# Altium schematic sheet [01] Main.SchDoc: Design 1
size Tabloid; Engineer: The ASID Designer; Organization: ASID Designer; Address1: Iran; Address2: Shiraz; Address3: P.O.Box 71765-385; DocumentNumber: 1; Revision: 1.0; SheetNumber: 1; SheetTotal: 1
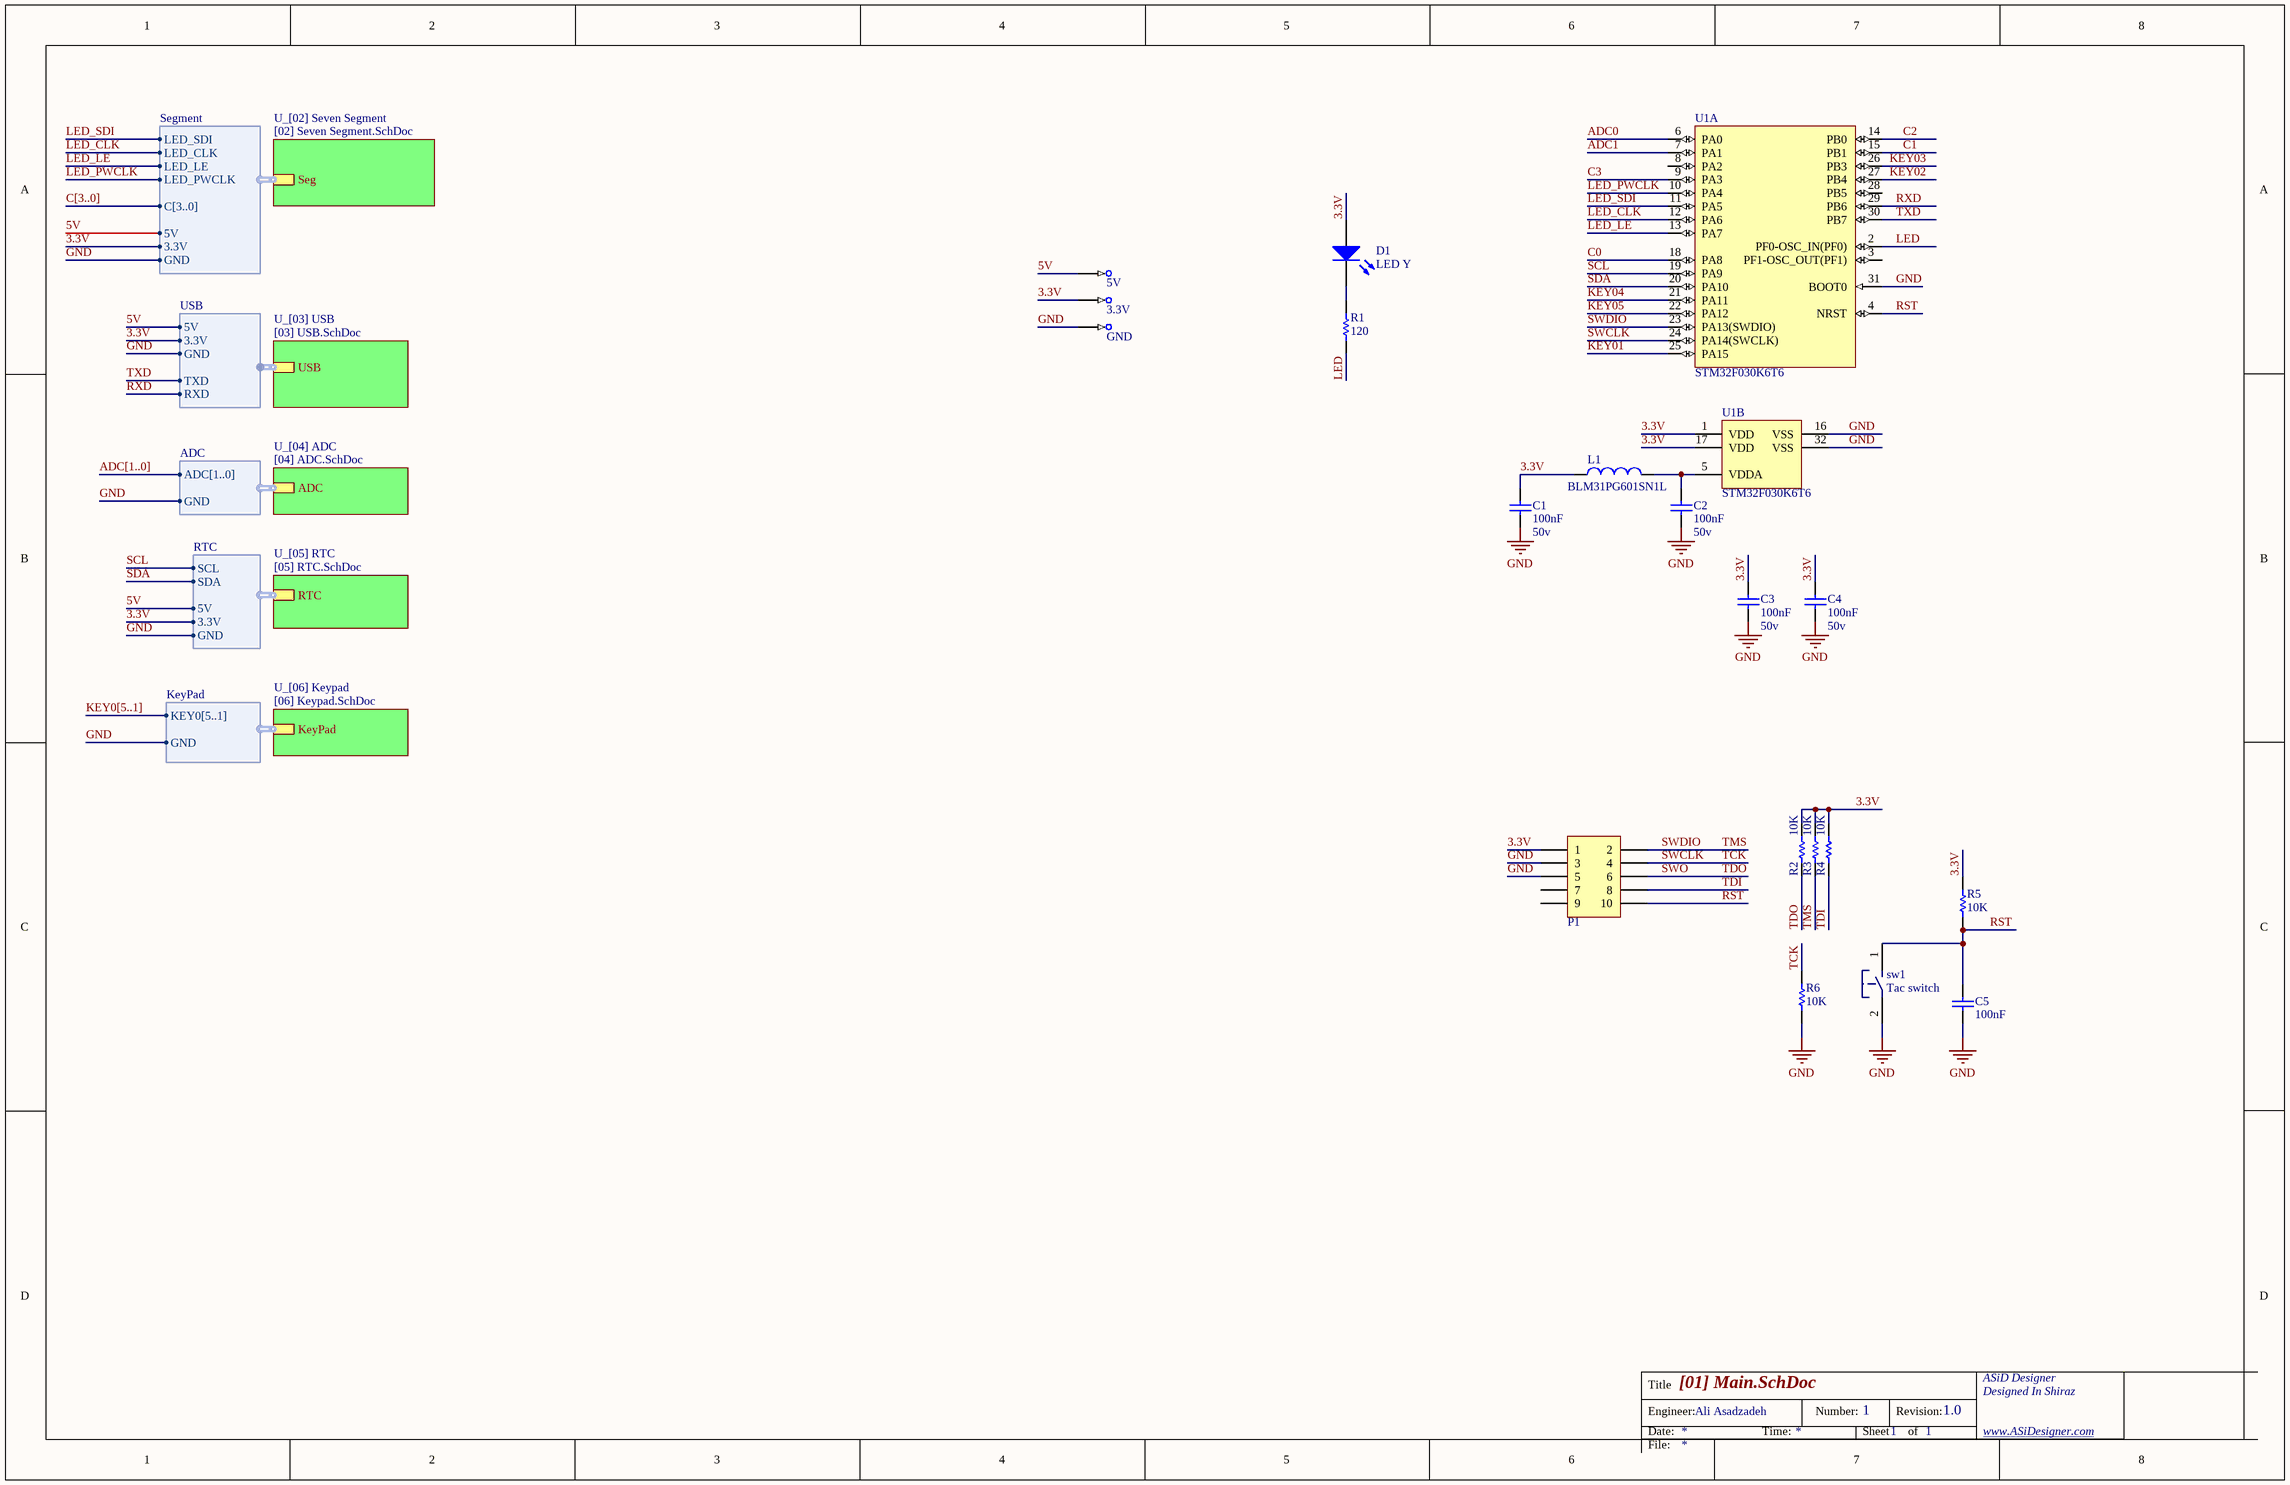
[diagram p0: [01] Main.SchDoc]

## Parts
C1  Volte: 50v  [MY_0603]  (hidden comment: 100nF)
C2  Volte: 50v  [MY_0603]  (hidden comment: 100nF)
C3  Volte: 50v  [MY_0603]  (hidden comment: 100nF)
C4  Volte: 50v  [MY_0603]  (hidden comment: 100nF)
C5  100nF  [MY_0805]
D1  LED Y  [MY_LED_0805]
L1  BLM31PG601SN1L  [MY_1206]
P1  Header 5X2  [MY_2X05_BOX]  (value not drawn)
R1  120  [MY_0805]
R2  10K  [MY_0805]
R3  10K  [MY_0805]
R4  10K  [MY_0805]
R5  10K  [MY_0805]
R6  10K  [MY_0805]
sw1  Tac switch  [MY_PB-SMD]
TP1  5V  [MY_TestPin]  (no BOM)
TP2  3.3V  [MY_TestPin]  (no BOM)
TP3  GND  [MY_TestPin]  (no BOM)
U1  STM32F030K6T6  [STM-LQFP32_N]  (parts A,B of 2)

## Sub-sheets
U_[02] Seven Segment = [02] Seven Segment.SchDoc: Seg (harness Segment)
U_[03] USB = [03] USB.SchDoc: USB (harness USB)
U_[04] ADC = [04] ADC.SchDoc: ADC (harness ADC)
U_[05] RTC = [05] RTC.SchDoc: RTC (harness RTC)
U_[06] Keypad = [06] Keypad.SchDoc: KeyPad (harness KeyPad)

## Harnesses
ADC: ADC[1..0], GND
RTC: SCL, SDA, 5V, 3.3V, GND
KeyPad: GND, KEY0[5..1]
Segment: C[3..0], 5V, LED_SDI, LED_CLK, LED_LE, LED_PWCLK, 3.3V, GND
USB: 5V, GND, TXD, RXD, 3.3V

## Nets
GND: C1.1 C2.1 C3.1 C4.1 C5.1 P1.3 P1.5 R6.2 sw1.2 TP3.1 U1.16(VSS) U1.31(BOOT0) U1.32(VSS) ; sheet U_[04] ADC/ADC.GND, sheet U_[05] RTC/RTC.GND, sheet U_[06] Keypad/KeyPad.GND, sheet U_[02] Seven Segment/Seg.GND, sheet U_[03] USB/USB.GND
3.3V: C1.2 C3.2 C4.2 D1.A L1.1 P1.1 R2.1 R3.1 R4.1 R5.1 TP2.1 U1.1(VDD) U1.17(VDD) ; sheet U_[05] RTC/RTC.3.3V, sheet U_[02] Seven Segment/Seg.3.3V, sheet U_[03] USB/USB.3.3V
5V: TP1.1 ; sheet U_[05] RTC/RTC.5V, sheet U_[02] Seven Segment/Seg.5V, sheet U_[03] USB/USB.5V
ADC0: U1.6(PA0)
ADC1: U1.7(PA1)
C0: U1.18(PA8)
C1: U1.15(PB1)
C2: U1.14(PB0)
C3: U1.9(PA3)
KEY01: U1.25(PA15)
KEY02: U1.27(PB4)
KEY03: U1.26(PB3)
KEY04: U1.21(PA11)
KEY05: U1.22(PA12)
LED: R1.1 U1.2(PF0-OSC_IN(PF0))
LED_CLK: U1.12(PA6) ; sheet U_[02] Seven Segment/Seg.LED_CLK
LED_LE: U1.13(PA7) ; sheet U_[02] Seven Segment/Seg.LED_LE
LED_PWCLK: U1.10(PA4) ; sheet U_[02] Seven Segment/Seg.LED_PWCLK
LED_SDI: U1.11(PA5) ; sheet U_[02] Seven Segment/Seg.LED_SDI
RST: C5.2 P1.10 R5.2 sw1.1 U1.4(NRST)
RXD: U1.29(PB6) ; sheet U_[03] USB/USB.RXD
SCL: U1.19(PA9) ; sheet U_[05] RTC/RTC.SCL
SDA: U1.20(PA10) ; sheet U_[05] RTC/RTC.SDA
SWCLK: P1.4 R6.1 U1.24(PA14(SWCLK))  [also labelled TCK]
SWDIO: P1.2 R3.2 U1.23(PA13(SWDIO))  [also labelled TMS]
SWO: P1.6 R2.2  [also labelled TDO]
TDI: P1.8 R4.2
TXD: U1.30(PB7) ; sheet U_[03] USB/USB.TXD
NetC2_2: C2.2 L1.2 U1.5(VDDA)
NetD1_K: D1.K R1.2

Not connected (* = marked no-connect by the designer): P1 7 9; U1 3(PF1-OSC_OUT(PF1)) 8(PA2) 28(PB5)

## Buses and harness runs
bus ADC[1..0]
bus C[3..0]
bus KEY0[5..1]

## Notes on the sheet
- Title
- Engineer:
- Date:
- Ali Asadzadeh
- Time:
- Number:
- Sheet
- Revision:
- of
- www.ASiDesigner.com
- Designed In Shiraz
- ASiD Designer
- File:

## Library data of the parts
C1-C4 = Cap ceramic: None polar capacitor; ASiD Part Number: C-AS; Value: 100nF
C5 = Cap ceramic: CAP-100Nf; Value: 100nF
D1 = LED: Typical INFRARED GaAs LED; ASiD Part Number: LED-AS
L1 = Inductor: ASiD Part Number: Inductor-AS; Current: 1A; Value: BLM31PG601SN1L
P1 = Header 5X2: Header, 10-Pin, Dual row; ASiD Part Number: Header 5X2-AS
R1 = Res: Standard resistor; ASiD Part Number: Res-AS; Value: 120
R2-R6 = Res: resistor 1/4 wat; Value: 10K
sw1 = Tac switch: small tac switch; ASiD Part Number: Tac switch-AS
TP1-TP3 = Test Point: ASiD Part Number: Test Point-AS
U1 = STM32F030K6T6: ARM Cortex-M0 32-bit MCU, 32 KB Flash, 4 KB Internal RAM, 26 I/Os, 32-pin LQFP, -40 to 85 degC, Tray; FLASH Size (Prog) (kB): 32; I/Os (High Current): 26; Internal RAM Size (kB): 4; Operating Frequency(F) (Processor speed) (MHz): 48; Supply Voltage(Vcc) min (V): 2.4; DatasheetVersion: Rev. 1; PackageVersion: Rev. 1, 07/2013; PackageReference: LQFP32; PackageDescription: 32-Pin Low Profile Quad Flat Package, 7 x 7 mm Body, 0.8 mm Pitch; Supplier 1: Digi-Key; Supplier Part Number 1: 497-14046-ND; Supplier 2: Newark; Supplier Part Number 2: 19X6194; Supplier 3: Mouser; Supplier Part Number 3: 511-STM32F030K6T6; Core: ARM Cortex-M0; Packing: Tray; Mounting Technology: Surface Mount; PartNumber: STM32F030K6T6; ComponentLink1Description: Manufacturer URL; ComponentLink1URL: http://www.st.com/web/en/home.html; ComponentLink2Description: Datasheet; ComponentLink2URL: http://www.st.com/st-web-ui/static/active/en/resource/technical/document/datasheet/DM00088500.pdf; ComponentLink3Description: Package Specification; ComponentLink3URL: http://www.st.com/st-web-ui/static/active/en/resource/technical/document/datasheet/DM00088500.pdf